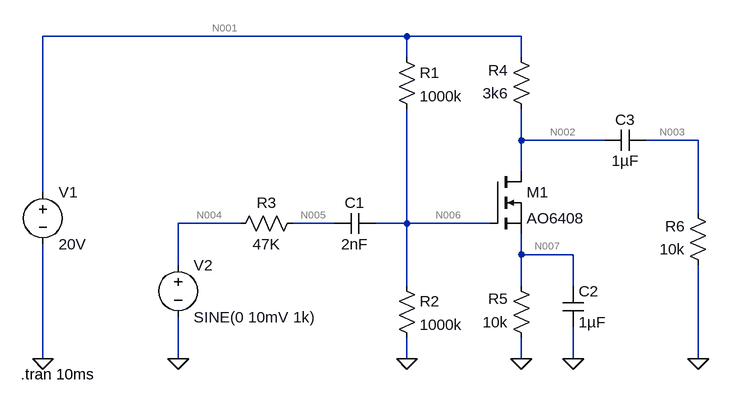
[diagram p0: schematic amplificador-jfet.asc]
amplificador-jfet.asc, the LTspice schematic file:
Version 4
SHEET 1 1416 680
WIRE 448 -208 -112 -208
WIRE 624 -208 448 -208
WIRE 448 -176 448 -208
WIRE 624 -176 624 -208
WIRE 624 -48 624 -96
WIRE 752 -48 624 -48
WIRE 896 -48 816 -48
WIRE 624 0 624 -48
WIRE -112 32 -112 -208
WIRE 896 64 896 -48
WIRE 192 80 96 80
WIRE 336 80 272 80
WIRE 448 80 448 -96
WIRE 448 80 400 80
WIRE 576 80 448 80
WIRE 624 128 624 96
WIRE 704 128 624 128
WIRE 96 144 96 80
WIRE 448 176 448 80
WIRE 624 176 624 128
WIRE 704 176 704 128
WIRE -112 288 -112 112
WIRE 96 288 96 224
WIRE 448 288 448 256
WIRE 624 288 624 256
WIRE 704 288 704 240
WIRE 896 288 896 144
FLAG 96 288 0
FLAG -112 288 0
FLAG 448 288 0
FLAG 624 288 0
FLAG 704 288 0
FLAG 896 288 0
SYMBOL voltage -112 16 R0
WINDOW 123 0 0 Left 0
WINDOW 39 0 0 Left 0
SYMATTR InstName V1
SYMATTR Value 20V
SYMBOL voltage 96 128 R0
WINDOW 123 0 0 Left 0
WINDOW 39 0 0 Left 0
SYMATTR InstName V2
SYMATTR Value SINE(0 10mV 1k)
SYMBOL res 432 -192 R0
SYMATTR InstName R1
SYMATTR Value 1000k
SYMBOL res 432 160 R0
SYMATTR InstName R2
SYMATTR Value 1000k
SYMBOL res 288 64 R90
WINDOW 0 0 56 VBottom 2
WINDOW 3 32 56 VTop 2
SYMATTR InstName R3
SYMATTR Value 47K
SYMBOL res 640 -80 R180
WINDOW 0 36 76 Left 2
WINDOW 3 36 40 Left 2
SYMATTR InstName R4
SYMATTR Value 3k6
SYMBOL res 640 272 R180
WINDOW 0 36 76 Left 2
WINDOW 3 36 40 Left 2
SYMATTR InstName R5
SYMATTR Value 10k
SYMBOL res 912 160 R180
WINDOW 0 36 76 Left 2
WINDOW 3 36 40 Left 2
SYMATTR InstName R6
SYMATTR Value 10k
SYMBOL cap 400 64 R90
WINDOW 0 0 32 VBottom 2
WINDOW 3 32 32 VTop 2
SYMATTR InstName C1
SYMATTR Value 2nF
SYMBOL cap 688 176 R0
SYMATTR InstName C2
SYMATTR Value 1µF
SYMBOL cap 816 -64 R90
WINDOW 0 0 32 VBottom 2
WINDOW 3 32 32 VTop 2
SYMATTR InstName C3
SYMATTR Value 1µF
SYMBOL nmos 576 0 R0
SYMATTR InstName M1
SYMATTR Value AO6408
TEXT -146 312 Left 2 !.tran 10ms

The netlist it stands for:
* amplificador-jfet.asc
V1 N001 0 20V
V2 N004 0 SINE(0 10mV 1k)
R1 N001 N006 1000k
R2 N006 0 1000k
R3 N005 N004 47K
R4 N002 N001 3k6
R5 0 N007 10k
R6 0 N003 10k
C1 N006 N005 2nF
C2 N007 0 1µF
C3 N003 N002 1µF
M1 N002 N006 N007 N007 AO6408
.model NMOS NMOS
.model PMOS PMOS
.lib standard.mos
.tran 10ms
.backanno
.end

* Results of the author's LTspice run, read from the files saved beside the schematic
* Operating Point, zero values left out:
*   V(n001) = 20 V
*   V(n006) = 10 V
*   V(n002) = 16.65 V
*   V(n007) = 9.307 V
*   Id(M1) = 930.7 µA
*   Is(M1) = -930.7 µA
*   I(R5) = -930.7 µA
*   I(R4) = -930.7 µA
*   I(R2) = 10 µA
*   I(R1) = 10 µA
*   I(V1) = -940.7 µA
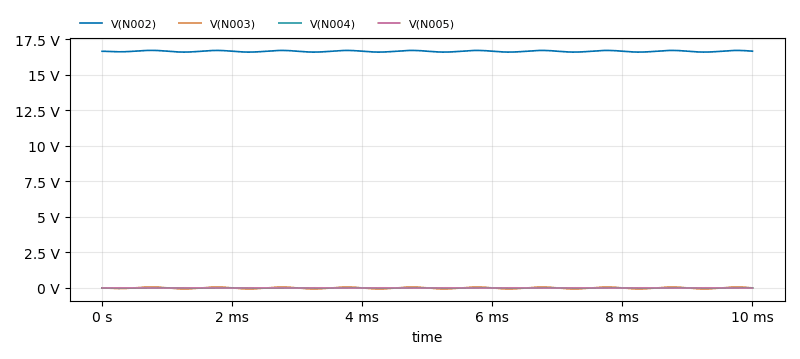
[diagram p1: Transient Analysis of amplificador-jfet.asc, plotted from the saved traces]
* Transient Analysis, 1 run:
*   V(N002): min 16.59 V, max 16.71 V, average 16.65 V, rms 16.65 V, last 16.65 V
*   V(N003): min -59.02 mV, max 62.88 mV, average 921.4 µV, rms 40.74 mV, last 3.303 mV
*   V(N004): min -9.998 mV, max 9.998 mV, average 149 nV, rms 7.072 mV, last 0 V
*   V(N005): min -10.57 mV, max 10.44 mV, average 12.33 µV, rms 7.365 mV, last -4.843 mV